# EAGLE schematic bar_graph_blog_post (EAGLE 7.4.0)
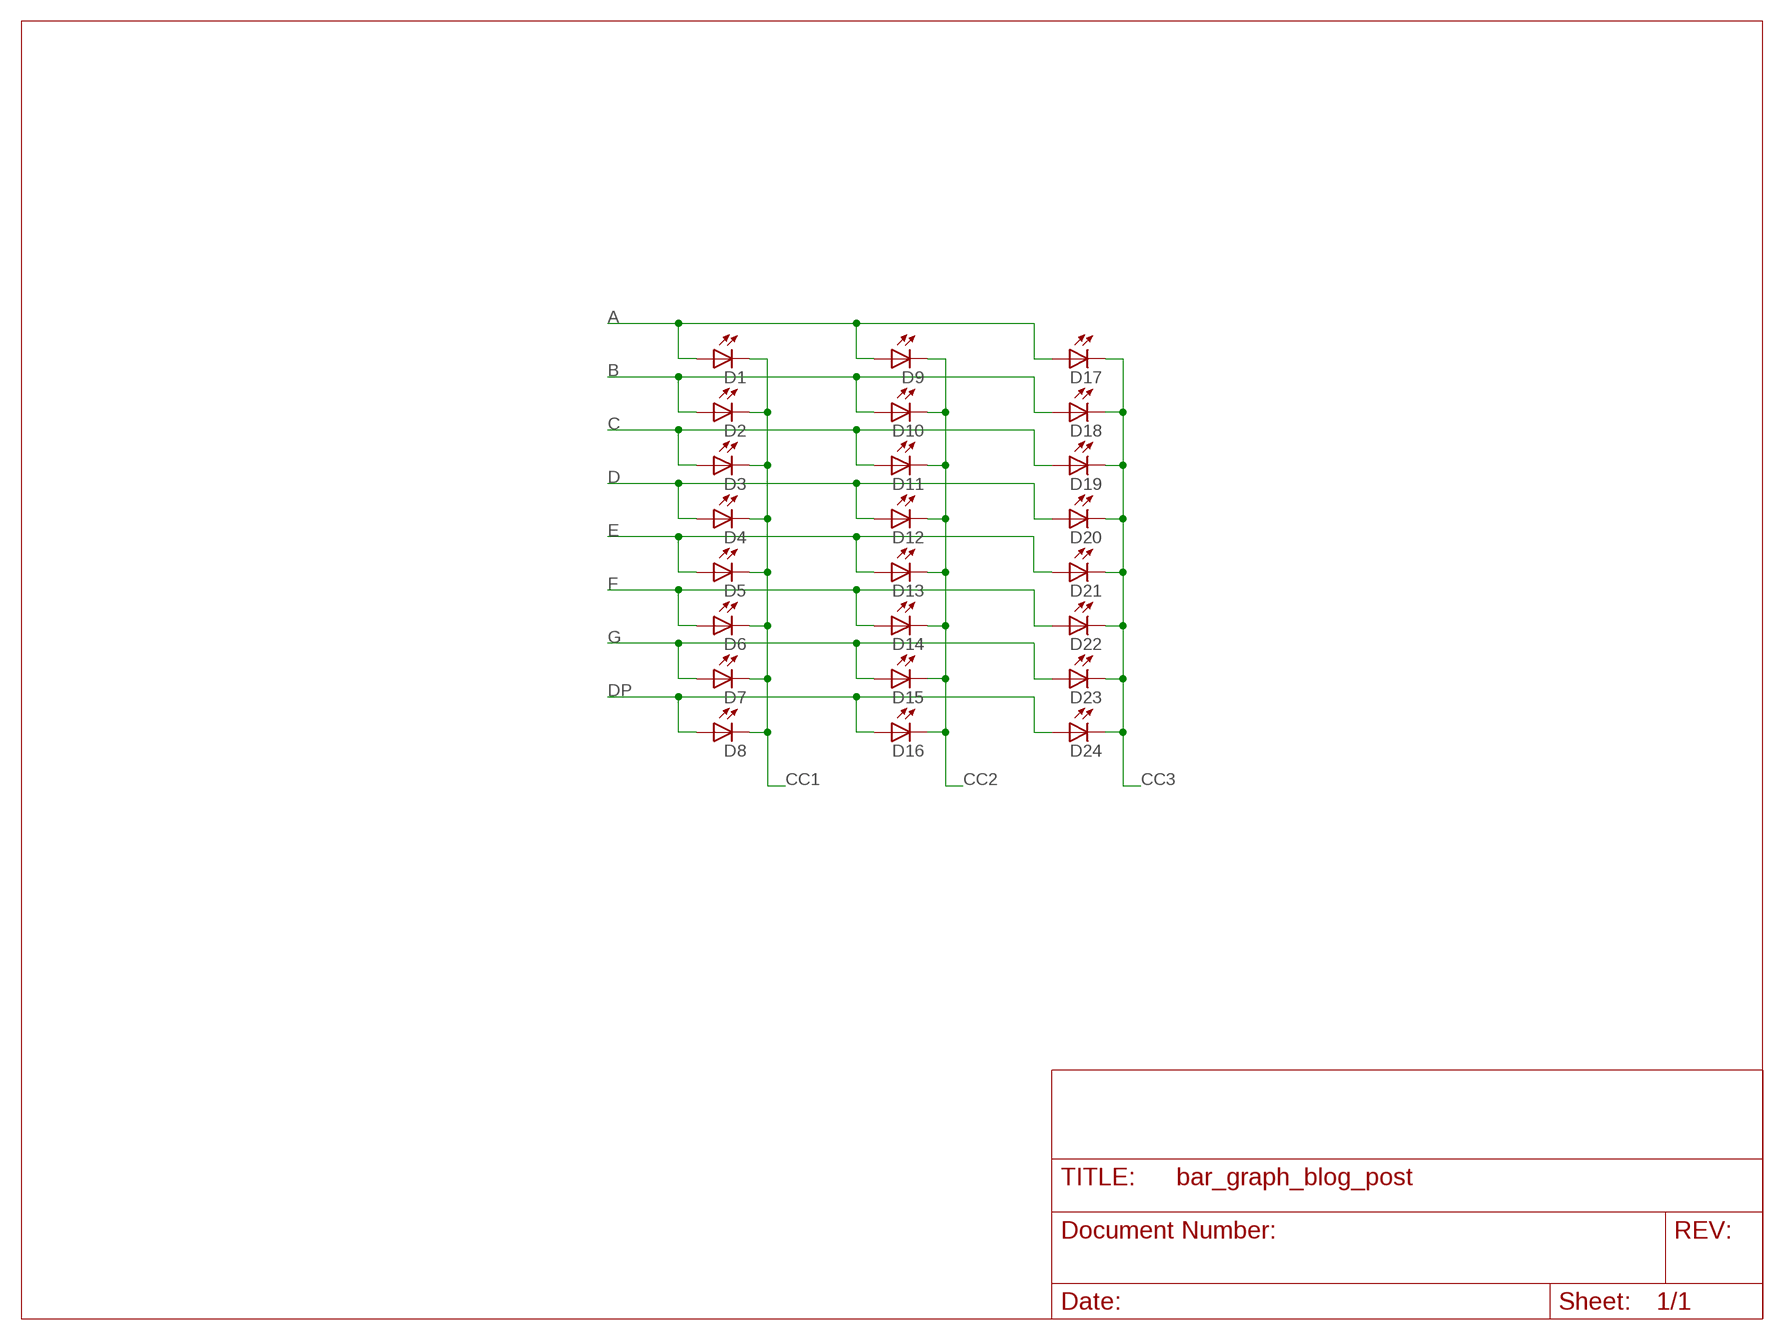
[diagram p0: schematic, sheet 1]

## Parts
D1  LEDSQR2X5  [LED2X5]
D2  LEDSQR2X5  [LED2X5]
D3  LEDSQR2X5  [LED2X5]
D4  LEDSQR2X5  [LED2X5]
D5  LEDSQR2X5  [LED2X5]
D6  LEDSQR2X5  [LED2X5]
D7  LEDSQR2X5  [LED2X5]
D8  LEDSQR2X5  [LED2X5]
D9  LEDSQR2X5  [LED2X5]
D10  LEDSQR2X5  [LED2X5]
D11  LEDSQR2X5  [LED2X5]
D12  LEDSQR2X5  [LED2X5]
D13  LEDSQR2X5  [LED2X5]
D14  LEDSQR2X5  [LED2X5]
D15  LEDSQR2X5  [LED2X5]
D16  LEDSQR2X5  [LED2X5]
D17  LEDSQR2X5  [LED2X5]
D18  LEDSQR2X5  [LED2X5]
D19  LEDSQR2X5  [LED2X5]
D20  LEDSQR2X5  [LED2X5]
D21  LEDSQR2X5  [LED2X5]
D22  LEDSQR2X5  [LED2X5]
D23  LEDSQR2X5  [LED2X5]
D24  LEDSQR2X5  [LED2X5]

## Nets
A: D1.A D9.A D17.A
B: D2.A D10.A D18.A
C: D3.A D11.A D19.A
CC1: D1.K(C) D2.K(C) D3.K(C) D4.K(C) D5.K(C) D6.K(C) D7.K(C) D8.K(C)
CC2: D9.K(C) D10.K(C) D11.K(C) D12.K(C) D13.K(C) D14.K(C) D15.K(C) D16.K(C)
CC3: D17.K(C) D18.K(C) D19.K(C) D20.K(C) D21.K(C) D22.K(C) D23.K(C) D24.K(C)
D: D4.A D12.A D20.A
DP: D8.A D16.A D24.A
E: D5.A D13.A D21.A
F: D6.A D14.A D22.A
G: D7.A D15.A D23.A

## Library data of the parts
D1-D24 = led:LED: LED OSRAM: - CHIPLED LG R971, LG N971, LY N971, LG Q971, LY Q971, LO R971, LY R971 LH N974, LH R974 LS Q976, LO Q976, LY Q976 LO Q996 - Hyper CHIPLED LW Q18S LB Q993, LB Q99A, LB R99A - SideLED LS A670, LO A670, LY A670, LG A670, LP A670 LB A673, LV A673, LT A673, LW A673 LH A674 LY A675 LS A676, LA A676, LO A676, LY A676, LW A676 LS A679, LY A679, LG A679 - Hyper Micro SIDELED® LS Y876, LA Y876, LO Y876, LY Y876 LT Y87S - SmartLED LW L88C, LW L88S LB L89C, LB L89S, LG L890 LS L89K, LO L89K, LY L89K LS L896, LA L896, LO L896, LY L896 - TOPLED LS T670, LO T670, LY T670, LG T670, LP T670 LSG T670, LSP T670, LSY T670, LOP T670, LYG T670 LG T671, LOG T671, LSG T671 LB T673, LV T673, LT T673, LW T673 LH T674 LS T676, LA T676, LO T676, LY T676, LB T676, LH T676, LSB T676, LW T676 LB T67C, LV T67C, LT T67C, LS T67K, LO T67K, LY T67K, LW E67C LS E67B, LA E67B, LO E67B, LY E67B, LB E67C, LV E67C, LT E67C LW T67C LS T679, LY T679, LG T679 LS T770, LO T770, LY T770, LG T770, LP T770 LB T773, LV T773, LT T773, LW T773 LH T774 LS E675, LA E675, LY E675, LS T675 LS T776, LA T776, LO T776, LY T776, LB T776 LHGB T686 LT T68C, LB T68C - Hyper Mini TOPLED® LB M676 - Mini TOPLED Santana® LG M470 LS M47K, LO M47K, LY M47K Source: http://www.osram.convergy.de LUXEON: - LUMILED® LXK2-PW12-R00, LXK2-PW12-S00, LXK2-PW14-U00, LXK2-PW14-V00 LXK2-PM12-R00, LXK2-PM12-S00, LXK2-PM14-U00 LXK2-PE12-Q00, LXK2-PE12-R00, LXK2-PE12-S00, LXK2-PE14-T00, LXK2-PE14-U00 LXK2-PB12-K00, LXK2-PB12-L00, LXK2-PB12-M00, LXK2-PB14-N00, LXK2-PB14-P00, LXK2-PB14-Q00 LXK2-PR12-L00, LXK2-PR12-M00, LXK2-PR14-Q00, LXK2-PR14-R00 LXK2-PD12-Q00, LXK2-PD12-R00, LXK2-PD12-S00 LXK2-PH12-R00, LXK2-PH12-S00 LXK2-PL12-P00, LXK2-PL12-Q00, LXK2-PL12-R00 Source: www.luxeon.com KINGBRIGHT: KA-3528ASYC Source: www.kingbright.com